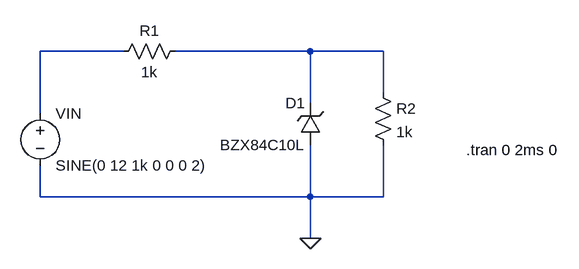
[diagram p0: schematic zener_diviseur.asc]
zener_diviseur.asc, the LTspice schematic file:
Version 4.1
SHEET 1 880 680
WIRE 80 160 -48 160
WIRE 368 160 160 160
WIRE 480 160 368 160
WIRE 480 224 480 160
WIRE 368 240 368 160
WIRE -48 256 -48 160
WIRE -48 384 -48 336
WIRE 368 384 368 304
WIRE 368 384 -48 384
WIRE 480 384 480 304
WIRE 480 384 368 384
WIRE 368 448 368 384
FLAG 368 448 0
SYMBOL zener 384 304 R180
WINDOW 0 24 64 Left 2
WINDOW 3 24 0 Left 2
SYMATTR InstName D1
SYMATTR Value BZX84C10L
SYMBOL res 464 208 R0
SYMATTR InstName R2
SYMATTR Value 1k
SYMBOL res 176 144 R90
WINDOW 0 0 56 VBottom 2
WINDOW 3 32 56 VTop 2
SYMATTR InstName R1
SYMATTR Value 1k
SYMBOL voltage -48 240 R0
SYMATTR InstName VIN
SYMATTR Value SINE(0 12 1k 0 0 0 2)
TEXT 608 312 Left 2 !.tran 0 2ms 0

The netlist it stands for:
* zener_diviseur.asc
D1 0 N002 BZX84C10L
R2 N002 0 1k
R1 N002 N001 1k
VIN N001 0 SINE(0 12 1k 0 0 0 2)
.model D D
.lib standard.dio
.tran 0 2ms 0
.backanno
.end